# Altium schematic sheet SENSORS.SchDoc
size A4; SheetNumber: 5; SheetTotal: 6
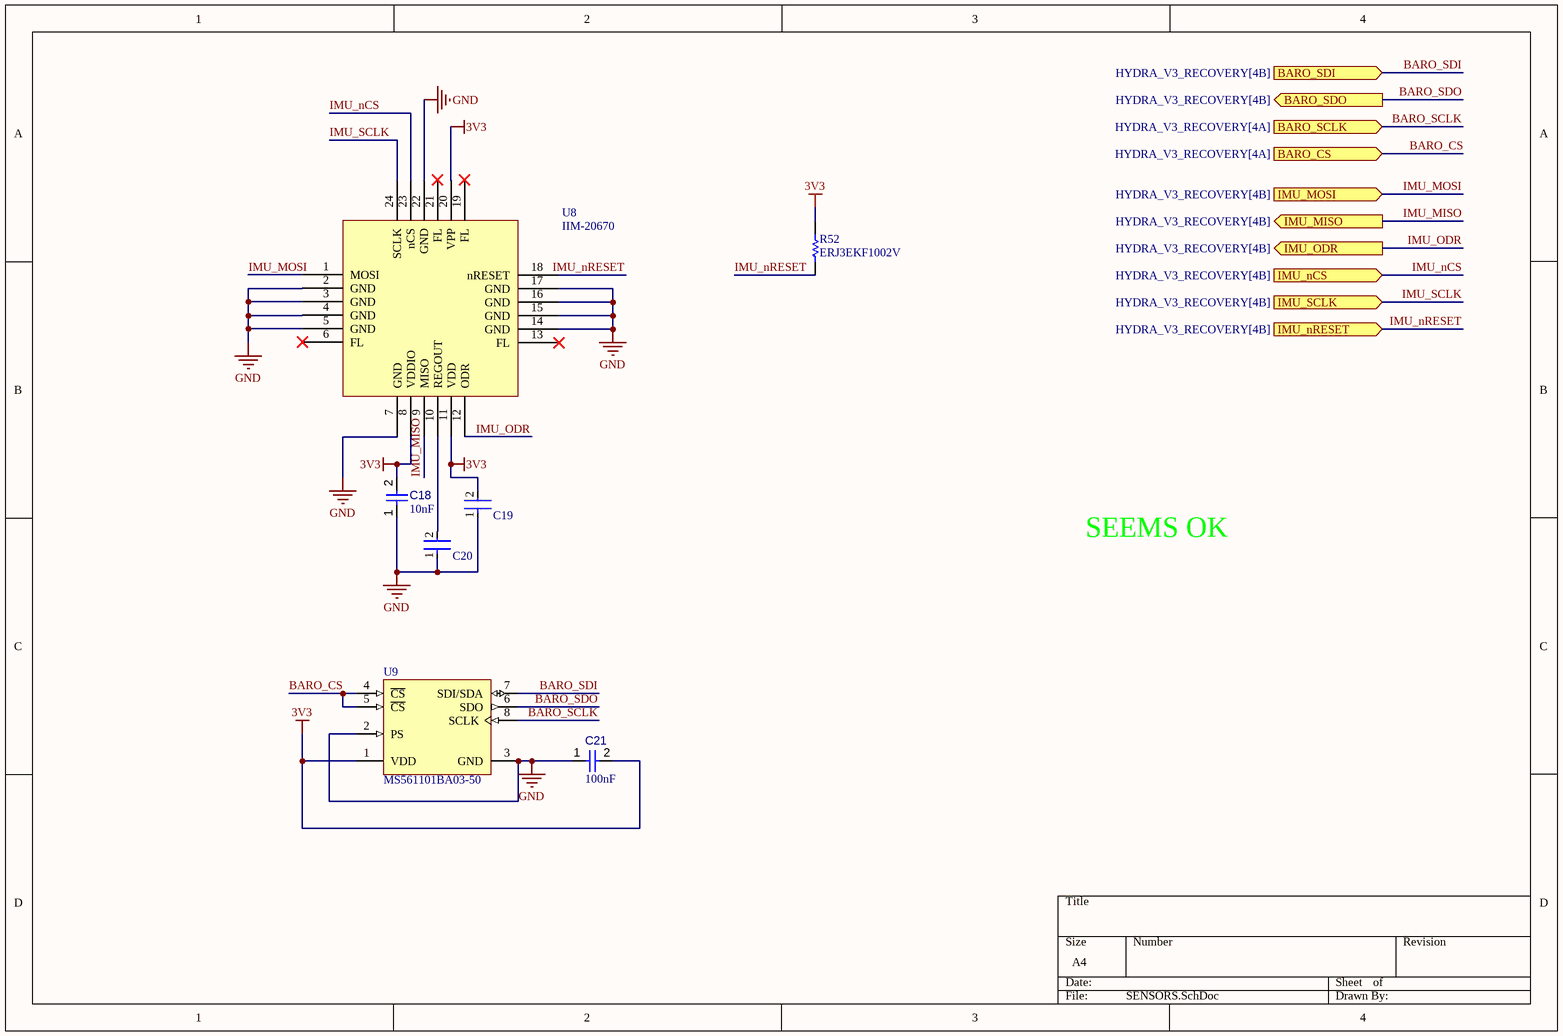
[diagram p0: SENSORS.SchDoc]

## Parts
C18  value 10nF  [CAPC0402(1005)60_L]  (hidden comment: Capacitor 10nF +/-20% 50V 0402)
C19  C0402C104K8PACTU  [FP-C0402-BB-MFG]  (value not drawn)
C20  C0402C104K8PACTU  [FP-C0402-BB-MFG]  (value not drawn)
C21  value 100nF  [CAPC0402(1005)60_L]  (hidden comment: Capacitor 100nF +/-20% 25V 0402)
R52  ERJ3EKF1002V  [RESC1609X55X30LL15T15]
U8  IIM-20670  [PQFN50P450X450X115_HS-25N]
U9  MS561101BA03-50  [MSI-MS561101BA03-50-8_V]

## Ports
BARO_CS (in, see HYDRA_V3_RECOVERY[4A]), BARO_SCLK (in, see HYDRA_V3_RECOVERY[4A]), BARO_SDI (in, see HYDRA_V3_RECOVERY[4B]), BARO_SDO (out, see HYDRA_V3_RECOVERY[4B]), IMU_MISO (out, see HYDRA_V3_RECOVERY[4B]), IMU_MOSI (in, see HYDRA_V3_RECOVERY[4B]), IMU_nCS (in, see HYDRA_V3_RECOVERY[4B]), IMU_nRESET (in, see HYDRA_V3_RECOVERY[4B]), IMU_ODR (out, see HYDRA_V3_RECOVERY[4B]), IMU_SCLK (in, see HYDRA_V3_RECOVERY[4B])

## Nets
3V3: C18.2 C19.2 C21.2 R52.2 U8.8(VDDIO) U8.11(VDD) U8.20(VPP) U9.1(VDD)
GND: C18.1 C19.1 C20.1 C21.1 U8.2(GND) U8.3(GND) U8.4(GND) U8.5(GND) U8.7(GND) U8.14(GND) U8.15(GND) U8.16(GND) U8.17(GND) U8.22(GND) U9.2(PS) U9.3(GND)
BARO_CS: U9.4(~{CS}) U9.5(~{CS}) ; port BARO_CS
BARO_SCLK: U9.8(SCLK) ; port BARO_SCLK
BARO_SDI: U9.7(SDI/SDA) ; port BARO_SDI
BARO_SDO: U9.6(SDO) ; port BARO_SDO
IMU_MISO: U8.9(MISO) ; port IMU_MISO
IMU_MOSI: U8.1(MOSI) ; port IMU_MOSI
IMU_nCS: U8.23(nCS) ; port IMU_nCS
IMU_nRESET: R52.1 U8.18(nRESET) ; port IMU_nRESET
IMU_ODR: U8.12(ODR) ; port IMU_ODR
IMU_SCLK: U8.24(SCLK) ; port IMU_SCLK
NetC20_2: C20.2 U8.10(REGOUT)

Not connected (* = marked no-connect by the designer): U8 6(FL)* 13(FL)* 19(FL)* 21(FL)*

## Notes on the sheet
- SEEMS OK

## Library data of the parts
C18 = CMP-001-00069-3: Chip Capacitor, 10nF +/-20%, 50V, 0402, Thickness 0.6 mm; Tolerance: 5%; Max Operating Temperature: 85°C; Pins: 2; Case/Package: 0402; Voltage Rating: 50V; Min Operating Temperature: -55°C; Mounting Technology: SMT
C19 C20 = CMP-2008-02046-2: CAP CER 0.1UF 10V X5R 0402; Manufacturer: Kemet; Material: Ceramic; Capacitance: 0.10 μF; Temperature Coefficient: 15%; Tolerance: 0.1; Value: 0.10 μF; Package: C0402-BB; Temperature: -55°C to +125°C; ComponentLink2Description: Datasheet; Temperature Characteristic: X5R; Device Class L1: Passive Components; Height: 0.55mm; Lead Free: Yes; ComponentLink2URL: https://content.kemet.com/datasheets/KEM_C1002_X7R_SMD.pdf; Device Class L2: Capacitors; Temperature Range Low: -55°C; Temperature Range High: +125°C; RoHS: TRUE; Octopart: https://octopart.com/c0402c104k8pactu-kemet-140039; Automotive: No; Mouser Description: Capacitor 100 nF 10 VDC 0402; Category: Cap; Voltage Rating: 10 V; Digikey Description: CAP CER 0.1UF 10V X5R 0402; Ipc Land Pattern Name: CAPC10050X50; Device Class L3: Ceramic Capacitors; Manufacturer Part Number: C0402C104K8PACTU
C21 = CMP-001-00065-4: Chip Capacitor, 100nF +/-20%, 25V, 0402, Thickness 0.6 mm; Tolerance: 10%; Max Operating Temperature: 85°C; Min Operating Temperature: -55°C; Pins: 2; Voltage Rating: 25V; Mounting Technology: SMT; Case/Package: 0402
R52 = CMP-1012-00623-3: Chip Resistor, 10 KOhm, +/- 1%, 0.1 W, -55 to 155 degC, 0603 (1608 Metric), RoHS, Tape and Reel; Manufacturer: Panasonic; Voltage Rating: 75V; Case\/Package: 0603; Power Rating: 100mW; Resistance: 10KOhm; Temperature Coefficient: 100ppm\/degreesC; Number of Pins: 2; Package Reference: 603; Depth: 0.8mm; Mount: SurfaceMount; Package Description: 2-Pin Surface Mount Device, Body 1.6 x 0.85 mm; Datasheet Version: 02/2017; Length: 1.6mm; Lead Free: LeadFree; Height: 0.45mm; Number of Terminations: 2; Max Power Dissipation: 100mW; Min Operating Temperature: -55degC; Datasheet URL: https://industrial.panasonic.com/cdbs/www-data/pdf/RDA0000/AOA0000C304.pdf; Termination: SMD/SMT; Case Code (Metric): 1608; Case Code (Imperial): 0603; Tolerance: 1%; Max Operating Temperature: 155degC; RoHSCompliant: true; Voltage Rating (DC): 75V; Radiation Hardening: No; Packaging: TapeandReel; Composition: ThickFilm; Mounting Technology: SurfaceMount; Manufacturer URL: http://www.panasonic.com/; Width: 0.031inch; REACH SVHC: NoSVHC; Contact Plating: Tin; Military Standard: Not; Package Quantity: 1
U8 = CMP-010-00026-2: IMUs - Inertial Measurement Units 6-axis Industrial IMU, Motion Tracking, SmartIndustrial; Datasheet: https://invensense.tdk.com/wp-content/uploads/2023/07/ds-000183_iim-20670-datasheet.pdf
U9 = CMP-2000-05251-1: Barometric Pressure Sensor, with Stainless Steel Cap, 1.8 to 3.6 V, -45 to 85 degC, 8-Pin QFN, RoHS, Tape and Reel; Manufacturer: Measurement Specialties; Operating Pressure Max: 1200mbar; Supply Current: 12.5µA; Supply Voltage Max: 3.6V; Supply Voltage Min: 1.8V; No. of Pins: 8; Connection Size: 0.5mm; SVHC: NoSVHC(20-Jun-2013); Operating Pressure Min: 10mbar; Manufacturer URL: http://www.meas-spec.com/; Operating Temperature Min: -40degC; Pressure Type: Barometric; Package Reference: MS561101BA03-50-8; Datasheet URL: http://www.te.com/commerce/DocumentDelivery/DDEController?Action=srchrtrv&DocNm=MS5611-01BA03&DocType=Data+Sheet&DocLang=English&DocFormat=pdf&PartCntxt=CAT-BLPS0036; Package Description: 8-Pin Surface Mount Device, Body 5 x 3 mm, Pitch 1.25 mm; Sensor Case Style: QFN; Datasheet Version: Sep-15; Operating Temperature Max: 85degC